# EAGLE design PIC32_Circuit (EAGLE 8.1.0)
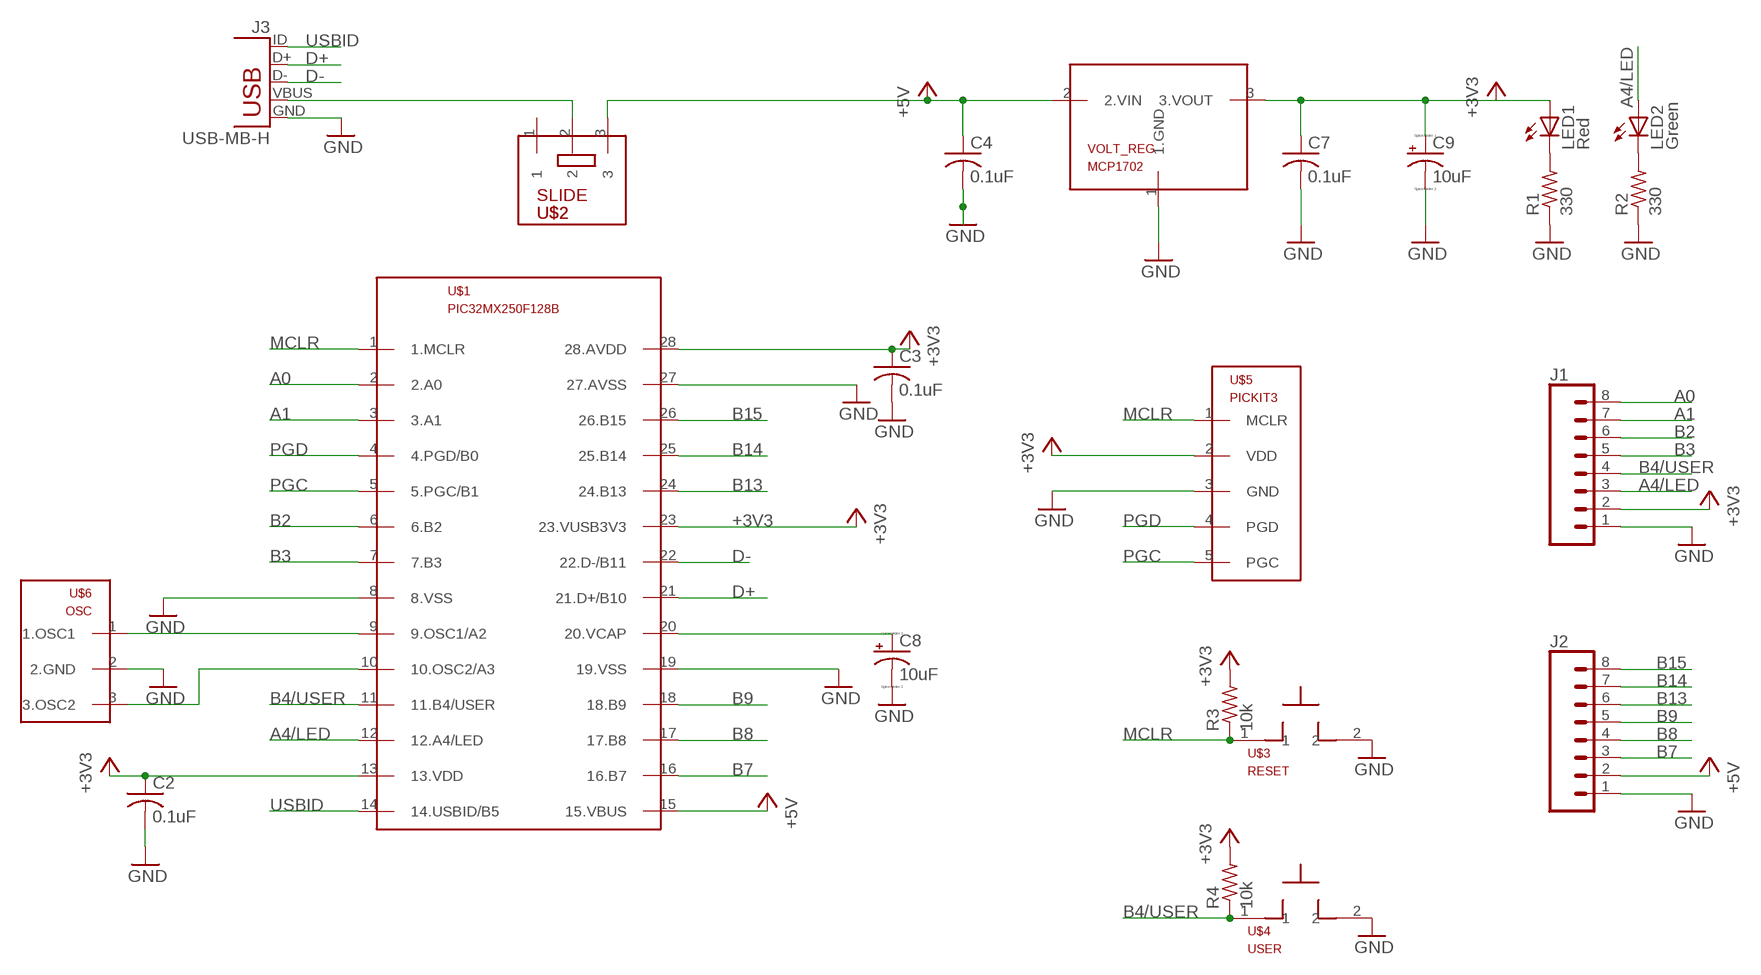
[diagram p0: schematic, sheet 1]

## Parts
C2  0.1uF  C-US025-050X050  [C025-050X050]
C3  0.1uF  C-US025-050X050  [C025-050X050]
C4  0.1uF  C-US025-050X050  [C025-050X050]
C7  0.1uF  C-US025-050X050  [C025-050X050]
C8  10uF  CPOL-USB45181B  [B45181B]
C9  10uF  CPOL-USB45181B  [B45181B]
J1  CONN_08"  [1X08]
J2  CONN_08"  [1X08]
J3  USB-MB-H  [USB-MB-H]
LED1  Red  LED3MM  [LED3MM]
LED2  Green  LED3MM  [LED3MM]
R1  330  R-US_0207/10  [0207/10]
R2  330  R-US_0207/10  [0207/10]
R3  10k  R-US_0207/10  [0207/10]
R4  10k  R-US_0207/10  [0207/10]
U$1  PIC32MX250F128B  [DIL28-3]
U$2  SLIDE  [SLIDE]
U$3  RESET  PB  [PB]
U$4  USER  PB  [PB]
U$5  PICKIT3  [1X05]
U$6  OSC  [OSC]
VOLT_REG  MCP1702  [TO92]

## Nets
+3V3: C2.1 C3.1 J1.2 R3.2 R4.2 U$1.13(13.VDD) U$1.23(23.VUSB3V3) U$1.28(28.AVDD) U$5.2(VDD)
+5V: C4.1 J2.2 U$1.15(15.VBUS) U$2.3 VOLT_REG.2(2.VIN)
A0: J1.8 U$1.2(2.A0)
A1: J1.7 U$1.3(3.A1)
A4/LED: J1.3 LED2.A U$1.12(12.A4/LED)
B2: J1.6 U$1.6(6.B2)
B3: J1.5 U$1.7(7.B3)
B4/USER: J1.4 R4.1 U$1.11(11.B4/USER) U$4.1
B7: J2.3 U$1.16(16.B7)
B8: J2.4 U$1.17(17.B8)
B9: J2.5 U$1.18(18.B9)
B13: J2.6 U$1.24(24.B13)
B14: J2.7 U$1.25(25.B14)
B15: J2.8 U$1.26(26.B15)
D+: J3.D+ U$1.21(21.D+/B10)
D-: J3.D- U$1.22(22.D-/B11)
GND: C2.2 C3.2 C4.2 C7.2 C8.- C9.- J1.1 J2.1 J3.GND R1.1 R2.1 U$1.8(8.VSS) U$1.19(19.VSS) U$1.27(27.AVSS) U$3.2 U$4.2 U$5.3(GND) U$6.2(2.GND) VOLT_REG.1(1.GND)
MCLR: R3.1 U$1.1(1.MCLR) U$3.1 U$5.1(MCLR)
N$1: LED1.K(C) R1.2
N$2: LED2.K(C) R2.2
N$3: C7.1 C9.+ LED1.A VOLT_REG.3(3.VOUT)
N$5: U$1.10(10.OSC2/A3) U$6.3(3.OSC2)
N$6: U$1.9(9.OSC1/A2) U$6.1(1.OSC1)
N$7: C8.+ U$1.20(20.VCAP)
PGC: U$1.5(5.PGC/B1) U$5.5(PGC)
PGD: U$1.4(4.PGD/B0) U$5.4(PGD)
USBID: J3.ID U$1.14(14.USBID/B5)
VBUS: J3.VBUS U$2.2
Unconnected: U$2.1

## Library data of the parts
C2-C4 C7 = PIC32-Circuit:C-US: CAPACITOR, American symbol
C8 C9 = PIC32-Circuit:CPOL-US: POLARIZED CAPACITOR, American symbol
J1 J2 = PIC32-Circuit:CONN_08: Multi connection point. Often used as Generic Header-pin footprint for 0.1 inch spaced/style header connections On any of the 0.1 inch spaced packages, you can populate with these: Break Away Headers - Straight <https://www.sparkfun.com/products/116> (PRT-00116) Break Away Male Headers - Right Angle <https://www.sparkfun.com/products/553> (PRT-00553) Female Headers <https://www.sparkfun.com/products/115> (PRT-00115) Break Away Headers - Machine Pin <https://www.sparkfun.com/products/117> (PRT-00117) Break Away Female Headers - Swiss Machine Pin <https://www.sparkfun.com/products/743> (PRT-00743) Arduino Stackable Header - 8 Pin <https://www.sparkfun.com/products/9279> (PRT-09279) For SCREWTERMINALS and SPRING TERMINALS visit here: Screw Terimnals on SparkFun.com <https://www.sparkfun.com/search/results?term=Screw+Terminals> (5mm/3.5mm/2.54mm spacing) This device is also useful as a general connection point to wire up your design to another part of your project. Our various solder wires solder well into these plated through hole pads. Hook-Up Wire - Assortment (Stranded, 22 AWG) <https://www.sparkfun.com/products/11375> (PRT-11375) Hook-Up Wire - Assortment (Solid Core, 22 AWG) <https://www.sparkfun.com/products/11367> (PRT-11367) View the entire wire category on our website here <https://www.sparkfun.com/categories/141> Special notes: Molex polarized connector foot print use with SKU : PRT-08231 with associated crimp pins and housings. 1MM SMD Version SKU: PRT-10208 NOTES ON THE VARIANTS LOCK and LOCK_LONGPADS... This footprint was designed to help hold the alignment of a through-hole component (i.e. 6-pin header) while soldering it into place. You may notice that each hole has been shifted either up or down by 0.005 of an inch from it's more standard position (which is a perfectly straight line). This slight alteration caused the pins (the squares in the middle) to touch the edges of the holes. Because they are alternating, it causes a "brace" to hold the component in place. 0.005 has proven to be the perfect amount of "off-center" position when using our standard breakaway headers. Although looks a little odd when you look at the bare footprint, once you have a header in there, the alteration is very hard to notice. Also,if you push a header all the way into place, it is covered up entirely on the bottom side.; PROD_ID: CONN-08438
J3 = PIC32-Circuit:USB: USB Connectors USB-B-PTH is fully proven SKU : PRT-00139/CONN-08278 USB-miniB is fully proven SKU : PRT-00587 USB-A-PCB is untested. USB-A-H is throughly reviewed, but untested. Spark Fun Electronics SKU : PRT-00437 USB-B-SMT is throughly reviewed, but untested. Needs silkscreen touching up. USB-A-S has not been used/tested USB-MB-H has not been used/tested USB-MICROB has been used. CONN-09505
LED1 = led:LED: LED OSRAM: - CHIPLED LG R971, LG N971, LY N971, LG Q971, LY Q971, LO R971, LY R971 LH N974, LH R974 LS Q976, LO Q976, LY Q976 LO Q996 - Hyper CHIPLED LW Q18S LB Q993, LB Q99A, LB R99A - SideLED LS A670, LO A670, LY A670, LG A670, LP A670 LB A673, LV A673, LT A673, LW A673 LH A674 LY A675 LS A676, LA A676, LO A676, LY A676, LW A676 LS A679, LY A679, LG A679 - Hyper Micro SIDELED® LS Y876, LA Y876, LO Y876, LY Y876 LT Y87S - SmartLED LW L88C, LW L88S LB L89C, LB L89S, LG L890 LS L89K, LO L89K, LY L89K LS L896, LA L896, LO L896, LY L896 - TOPLED LS T670, LO T670, LY T670, LG T670, LP T670 LSG T670, LSP T670, LSY T670, LOP T670, LYG T670 LG T671, LOG T671, LSG T671 LB T673, LV T673, LT T673, LW T673 LH T674 LS T676, LA T676, LO T676, LY T676, LB T676, LH T676, LSB T676, LW T676 LB T67C, LV T67C, LT T67C, LS T67K, LO T67K, LY T67K, LW E67C LS E67B, LA E67B, LO E67B, LY E67B, LB E67C, LV E67C, LT E67C LW T67C LS T679, LY T679, LG T679 LS T770, LO T770, LY T770, LG T770, LP T770 LB T773, LV T773, LT T773, LW T773 LH T774 LS E675, LA E675, LY E675, LS T675 LS T776, LA T776, LO T776, LY T776, LB T776 LHGB T686 LT T68C, LB T68C - Hyper Mini TOPLED® LB M676 - Mini TOPLED Santana® LG M470 LS M47K, LO M47K, LY M47K Source: http://www.osram.convergy.de LUXEON: - LUMILED® LXK2-PW12-R00, LXK2-PW12-S00, LXK2-PW14-U00, LXK2-PW14-V00 LXK2-PM12-R00, LXK2-PM12-S00, LXK2-PM14-U00 LXK2-PE12-Q00, LXK2-PE12-R00, LXK2-PE12-S00, LXK2-PE14-T00, LXK2-PE14-U00 LXK2-PB12-K00, LXK2-PB12-L00, LXK2-PB12-M00, LXK2-PB14-N00, LXK2-PB14-P00, LXK2-PB14-Q00 LXK2-PR12-L00, LXK2-PR12-M00, LXK2-PR14-Q00, LXK2-PR14-R00 LXK2-PD12-Q00, LXK2-PD12-R00, LXK2-PD12-S00 LXK2-PH12-R00, LXK2-PH12-S00 LXK2-PL12-P00, LXK2-PL12-Q00, LXK2-PL12-R00 Source: www.luxeon.com KINGBRIGHT: KA-3528ASYC Source: www.kingbright.com
LED2 = PIC32-Circuit:LED: LED OSRAM: - CHIPLED LG R971, LG N971, LY N971, LG Q971, LY Q971, LO R971, LY R971 LH N974, LH R974 LS Q976, LO Q976, LY Q976 LO Q996 - Hyper CHIPLED LW Q18S LB Q993, LB Q99A, LB R99A - SideLED LS A670, LO A670, LY A670, LG A670, LP A670 LB A673, LV A673, LT A673, LW A673 LH A674 LY A675 LS A676, LA A676, LO A676, LY A676, LW A676 LS A679, LY A679, LG A679 - Hyper Micro SIDELED® LS Y876, LA Y876, LO Y876, LY Y876 LT Y87S - SmartLED LW L88C, LW L88S LB L89C, LB L89S, LG L890 LS L89K, LO L89K, LY L89K LS L896, LA L896, LO L896, LY L896 - TOPLED LS T670, LO T670, LY T670, LG T670, LP T670 LSG T670, LSP T670, LSY T670, LOP T670, LYG T670 LG T671, LOG T671, LSG T671 LB T673, LV T673, LT T673, LW T673 LH T674 LS T676, LA T676, LO T676, LY T676, LB T676, LH T676, LSB T676, LW T676 LB T67C, LV T67C, LT T67C, LS T67K, LO T67K, LY T67K, LW E67C LS E67B, LA E67B, LO E67B, LY E67B, LB E67C, LV E67C, LT E67C LW T67C LS T679, LY T679, LG T679 LS T770, LO T770, LY T770, LG T770, LP T770 LB T773, LV T773, LT T773, LW T773 LH T774 LS E675, LA E675, LY E675, LS T675 LS T776, LA T776, LO T776, LY T776, LB T776 LHGB T686 LT T68C, LB T68C - Hyper Mini TOPLED® LB M676 - Mini TOPLED Santana® LG M470 LS M47K, LO M47K, LY M47K Source: http://www.osram.convergy.de LUXEON: - LUMILED® LXK2-PW12-R00, LXK2-PW12-S00, LXK2-PW14-U00, LXK2-PW14-V00 LXK2-PM12-R00, LXK2-PM12-S00, LXK2-PM14-U00 LXK2-PE12-Q00, LXK2-PE12-R00, LXK2-PE12-S00, LXK2-PE14-T00, LXK2-PE14-U00 LXK2-PB12-K00, LXK2-PB12-L00, LXK2-PB12-M00, LXK2-PB14-N00, LXK2-PB14-P00, LXK2-PB14-Q00 LXK2-PR12-L00, LXK2-PR12-M00, LXK2-PR14-Q00, LXK2-PR14-R00 LXK2-PD12-Q00, LXK2-PD12-R00, LXK2-PD12-S00 LXK2-PH12-R00, LXK2-PH12-S00 LXK2-PL12-P00, LXK2-PL12-Q00, LXK2-PL12-R00 Source: www.luxeon.com KINGBRIGHT: KA-3528ASYC Source: www.kingbright.com
R1-R4 = PIC32-Circuit:R-US_: RESISTOR, American symbol
U$1 = PIC32-Circuit:PIC32MX250F128B
U$2 = PIC32-Circuit:SLIDE
U$3 U$4 = PIC32-Circuit:PB
U$5 = PIC32-Circuit:PICKIT3
U$6 = PIC32-Circuit:OSC
VOLT_REG = PIC32-Circuit:MCP1702

## Board
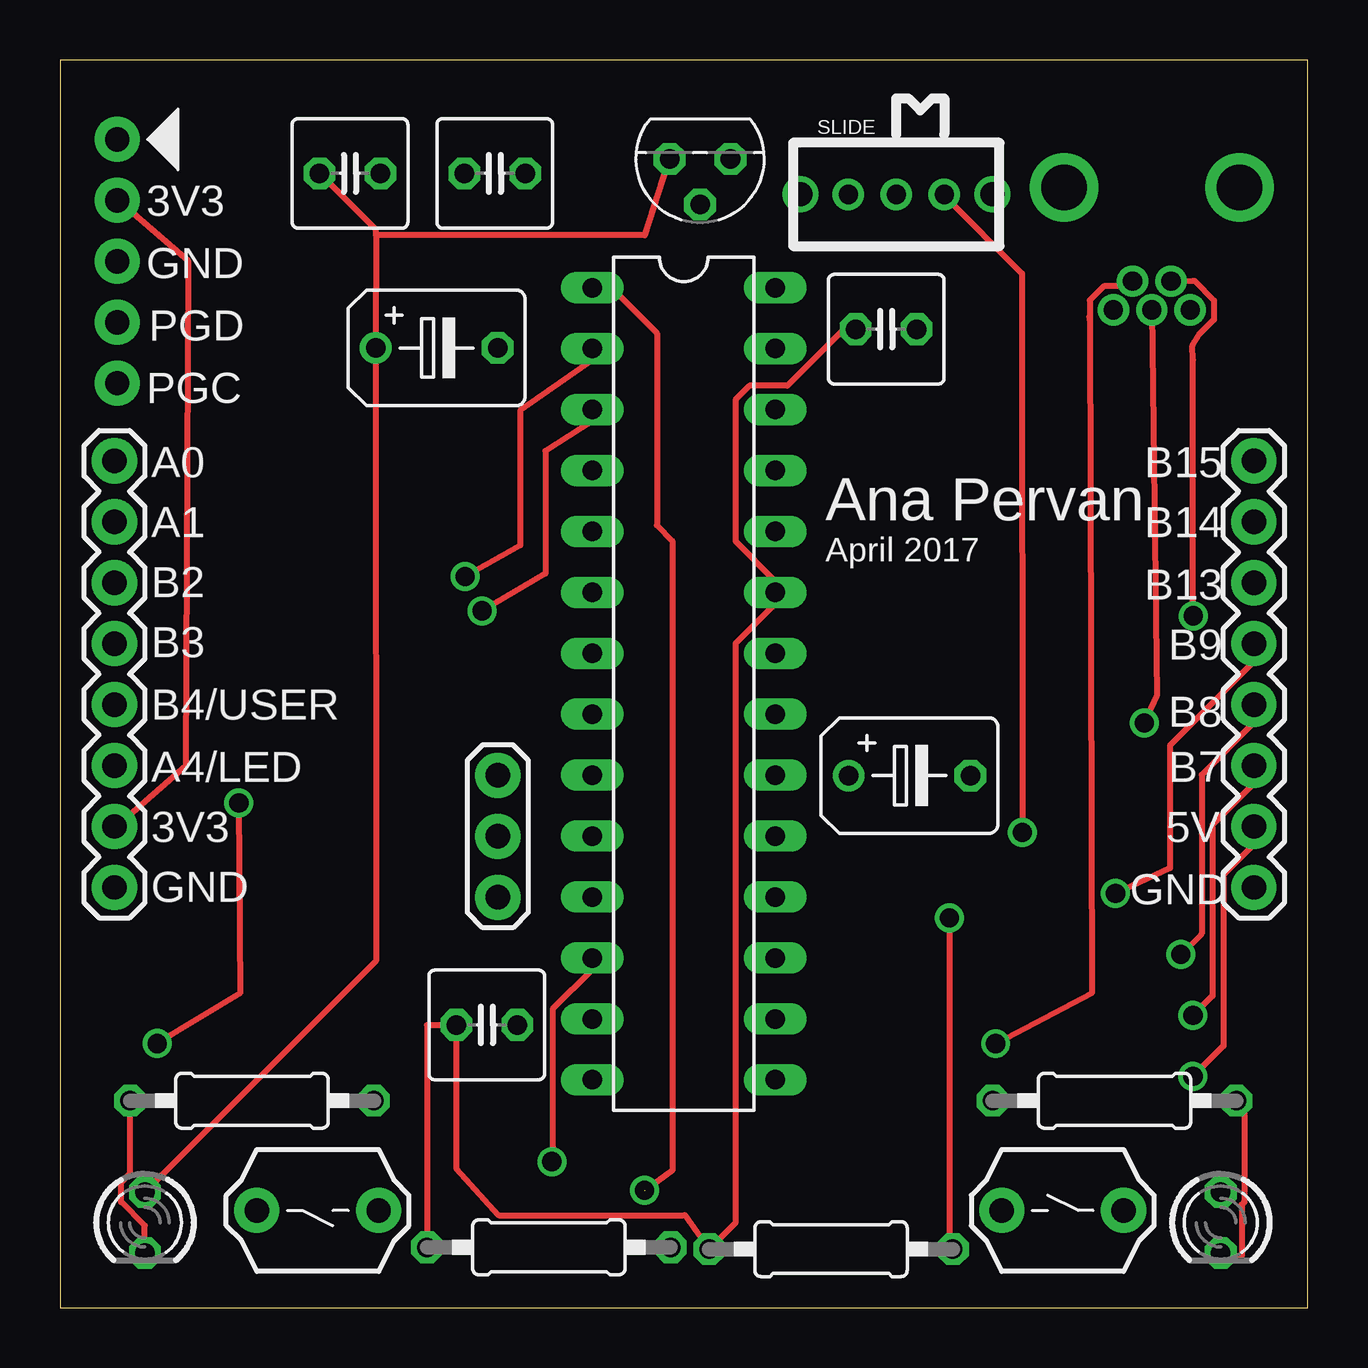
[diagram p1: board, top side]
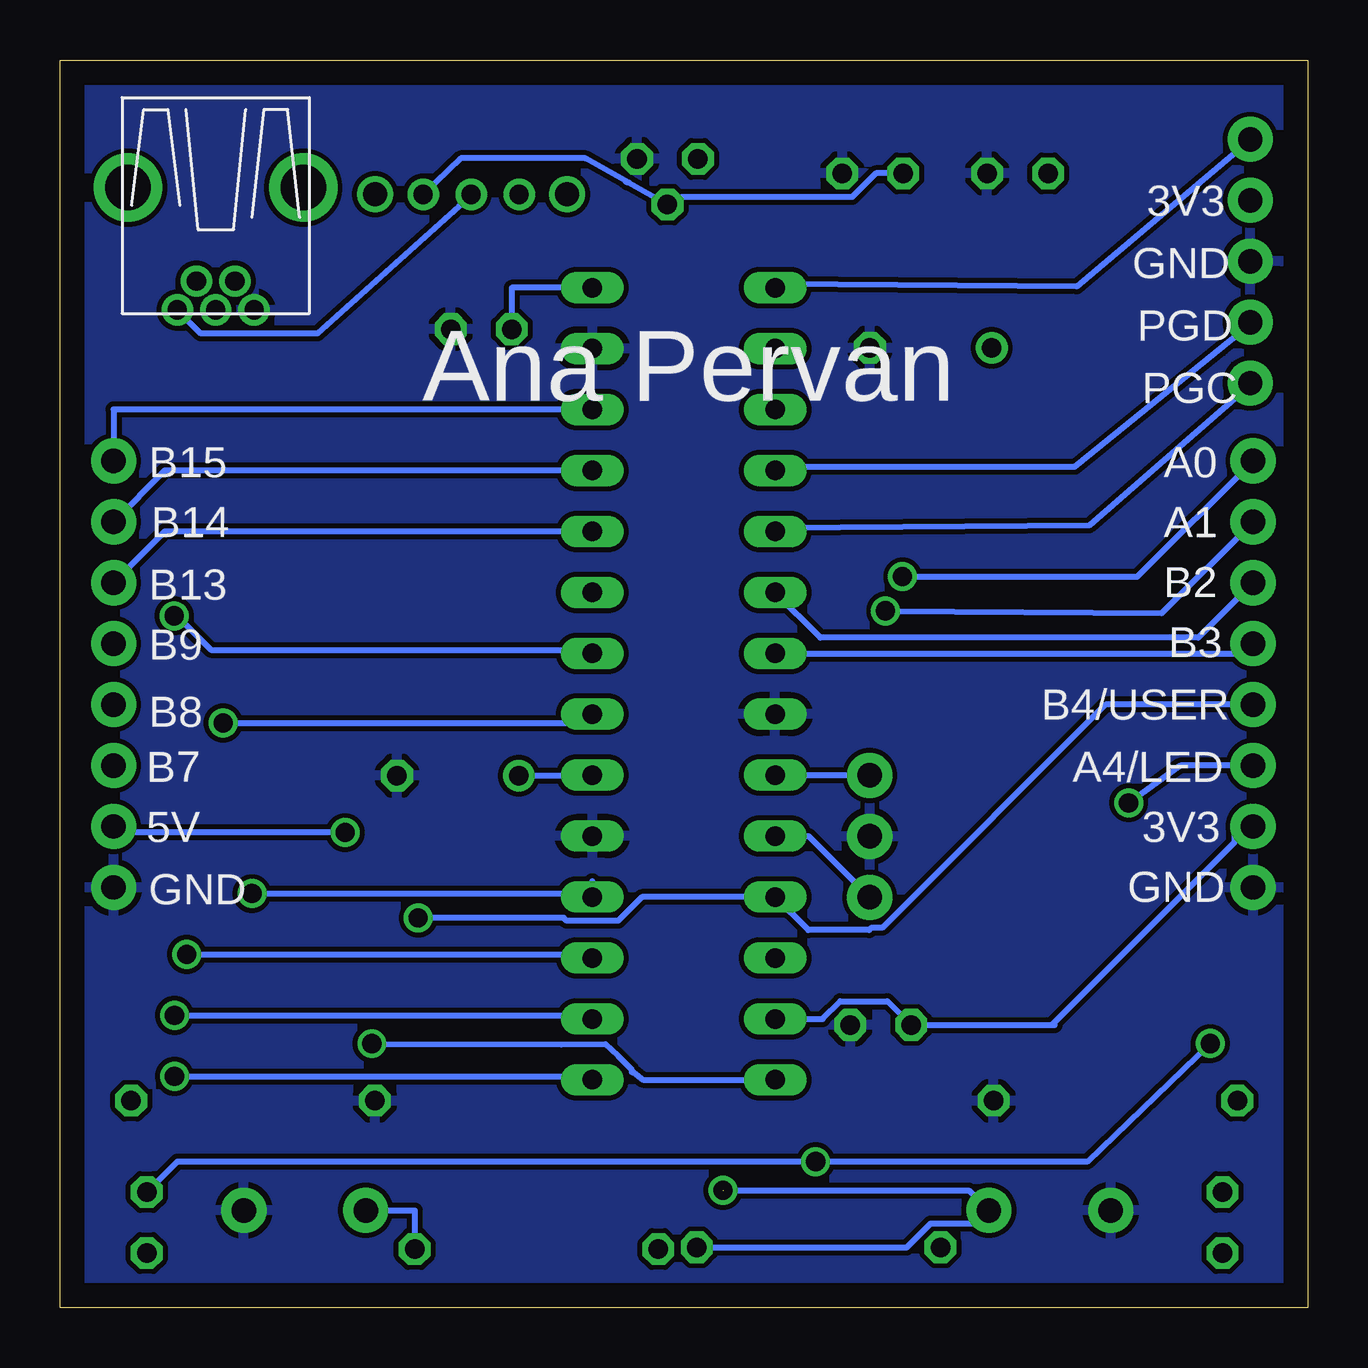
[diagram p2: board, bottom side, seen from below]

Size 52 x 52 mm. Coordinates in mm from the lower left corner, seen from the top.
Outline: 0,0 52,0 52,52 0,52 0,0
Copper layers (1*16): Top 0.035mm / dielectric 1.5mm / Bottom 0.035mm
Design rules "default": minimum track width 10mil, minimum drill 24mil, track to track 8mil, track to pad 8mil, pad to pad 8mil, via to via 8mil, smd to smd 8mil, copper to edge 40mil, drill to drill 8mil, minimum pad ring 10mil, minimum via ring 8mil, stop-mask expansion 4mil, vias tented up to drill 0mil, thermal gap 10mil

### Footprints (pad centres in the part's own frame; a part is rotated, then mirrored left to right if it is on the bottom)
C025-050X050 = drill 0.813 octagon: 1 -1.27,0; 2 1.27,0
B45181B = drill 0.813: + -2.54,0 | drill 0.813 octagon: - 2.54,0
1X08 = drill 1.016 pad 1.88: 1 0,0; 2 2.54,0; 3 5.08,0; 4 7.62,0; 5 10.16,0; 6 12.7,0; 7 15.24,0; 8 17.78,0
USB-MB-H = drill 0.8: D+ 5.1,0; D- 3.9,0.8; GND 5.1,-1.6; ID 3.9,-0.8; VBUS 5.1,1.6 | drill 1.9: P$6 0,-3.65; P$7 0,3.65
LED3MM = drill 0.813 octagon: A -1.27,0; K 1.27,0
0207/10 = drill 0.813 octagon: 1 -5.08,0; 2 5.08,0
DIL28-3 = drill 0.813 long: 1 -16.51,-3.81; 2 -13.97,-3.81; 3 -11.43,-3.81; 4 -8.89,-3.81; 5 -6.35,-3.81; 6 -3.81,-3.81; 7 -1.27,-3.81; 8 1.27,-3.81; 9 3.81,-3.81; 10 6.35,-3.81; 11 8.89,-3.81; 12 11.43,-3.81; 13 13.97,-3.81; 14 16.51,-3.81; 15 16.51,3.81; 16 13.97,3.81; 17 11.43,3.81; 18 8.89,3.81; 19 6.35,3.81; 20 3.81,3.81; 21 1.27,3.81; 22 -1.27,3.81; 23 -3.81,3.81; 24 -6.35,3.81; 25 -8.89,3.81; 26 -11.43,3.81; 27 -13.97,3.81; 28 -16.51,3.81
SLIDE = drill 0.8: 1 -2,0; 2 0,0; 3 2,0 | drill 1: P$1 -4,0; P$2 4,0
PB = drill 1.016 pad 1.88: 1 -2.54,0; 2 2.54,0
1X05 = drill 1.016 pad 1.88: 1 0,0; 2 2.54,0; 3 5.08,0; 4 7.62,0; 5 10.16,0
OSC = drill 1.016 pad 1.88: 1 -2.54,0; 2 0,0; 3 2.54,0
TO92 = drill 0.813 octagon: 1 -1.27,0; 2 0,1.905; 3 1.27,0

### Placement (x,y rotation side)
C2  17.79,11.78 0 top
C3  34.44,40.78 0 top
C4  18.12,47.27 0 top
C7  12.09,47.27 0 top
C8  35.41,22.17 0 top
C9  15.7,40 0 top
J1  2.27,17.51 90 top
J2  49.77,17.51 90 top
J3  45.51,46.68 270 top
LED1  3.54,3.54 270 top
LED2  48.38,3.54 270 top
R1  8,8.62 180 top
R2  43.95,8.62 0 top
R3  20.38,2.51 180 top
R4  32.14,2.43 180 top
U$1  26,26 270 top
U$2  34.86,46.4 0 top
U$3  10.74,4.05 180 top
U$4  41.79,4.05 0 top
U$5  2.39,48.69 270 top
U$6  18.25,19.64 270 top
VOLT_REG  26.68,47.88 180 top

### Tracks (layer width: path | path; a pad name or v marks a point on that pad's centre or on a via)
+3V3
  Top 0.254: J1.2 2.87,20.49 5.24,22.56 5.34,43.64 2.43,46.15 U$5.2 | C3.1 32.68,40.78 30.32,38.42 28.74,38.42 28.16,37.84 28.16,31.94 29.81,30.29 U$1.23 29.81,29.33 28.16,27.68 28.16,3.54 R4.2 26.04,3.85 18.27,3.85 16.52,5.8 C2.1 15.3,11.78 R3.2
  Bottom 0.254: 10.65,11.78 C2.1 17.51,12.77 19.47,12.77 20.21,12.03 U$1.13 | 10.65,11.78 10.54,11.78 | 10.65,11.78 3.03,19.4 3.03,19.8 2.27,19.8 J1.2 | U$1.28 33.17,42.51 C3.1
+5V  (via drill 0.8)
  Top 0.254: J2.2 49.77,19.31 48.5,18.04 48.5,10.91 v47.23,9.64 | U$2.3 36.86,46.34 40.1,43.1 v40.12,19.8
  Bottom 0.254: 29.81,9.64 U$1.15 29.96,9.64 v47.23,9.64 | v40.12,19.8 49.51,19.8 J2.2 | C4.1 17.99,47.27 18.98,46.28 26.08,46.28 VOLT_REG.2 28.3,46.89 28.36,46.89 28.43,46.96 30.1,47.9 35.3,47.9 U$2.3
A0  (via drill 0.8)
  Top 0.254: U$1.2 22.19,39.49 19.18,37.38 19.18,31.77 v16.88,30.46
  Bottom 0.254: v16.88,30.46 7.1,30.46 J1.8
A1  (via drill 0.8)
  Top 0.254: v17.59,29.04 20.24,30.59 20.24,35.7 22.19,36.95 U$1.3
  Bottom 0.254: v17.59,29.04 6.08,28.94 J1.7
A4/LED  (via drill 0.8)
  Top 0.254: U$1.12 22.19,14.09 20.54,12.44 20.54,6.12 v20.5,6.08 | v7.46,21.04 7.5,13.1 v4.06,11
  Bottom 0.254: J1.3 5.3,22.59 v7.46,21.04 | v4.06,11 9.18,6.08 v20.5,6.08 47.11,6.08 LED2.A
B2
  Bottom 0.254: J1.6 4.56,27.92 20.3,27.92 U$1.6
B3
  Bottom 0.254: U$1.7 2.27,27.27 J1.5
B4/USER  (via drill 0.8)
  Top 0.254: v37.07,16.24 37.07,2.58 R4.1
  Bottom 0.254: U$4.1 37.22,4.05 R4.1 | J1.4 8.42,25.13 17.72,15.83 18.17,15.83 18.27,15.73 20.81,15.73 U$1.11 27.75,17.11 28.74,16.12 30.88,16.12 31,16.24 v37.07,16.24
B7  (via drill 0.8)
  Top 0.254: J2.3 49.77,21.85 48.04,20.12 48.04,12.99 v47.23,12.18
  Bottom 0.254: 29.81,12.18 U$1.16 29.96,12.18 v47.23,12.18
B8  (via drill 0.8)
  Top 0.254: v46.72,14.72 47.58,15.58 47.58,22.2 49.77,24.39 J2.4
  Bottom 0.254: 29.81,14.72 U$1.17 29.96,14.72 v46.72,14.72
B9  (via drill 0.8)
  Top 0.254: v44,17.26 46.26,18.32 46.26,23.42 49.77,26.93 J2.5
  Bottom 0.254: 29.81,17.76 U$1.18 29.96,17.26 v44,17.26
B13
  Bottom 0.254: U$1.24 47.63,32.35 J2.6
B14
  Bottom 0.254: U$1.25 47.63,34.89 J2.7
B15
  Bottom 0.254: U$1.26 49.77,37.43 J2.8
D+  (via drill 0.8)
  Top 0.254: J3.D+ 45.71,25.48 v45.2,24.37
  Bottom 0.254: v45.2,24.37 30.17,24.37 U$1.21
D-  (via drill 0.8)
  Top 0.254: v47.24,28.83 47.23,28.43 47.23,39.51 47.2,40.1 47.52,40.6 48.09,41.17 48.09,41.99 47.3,42.8 47.2,42.8 J3.D-
  Bottom 0.254: v47.24,28.83 46.72,28.43 45.7,27.42 29.96,27.42 U$1.22
GND
  pour Bottom: 0,52 52,52 52,0 0,0
MCLR  (via drill 0.8)  (1 unrouted)
  Top 0.254: U$1.1 22.99,42.51 24.88,40.62 24.88,32.61 25.53,31.96 25.53,5.71 24.37,4.86
  Bottom 0.254: R3.1 16.7,2.51 15.71,3.5 13.83,3.5 U$3.1 14.12,4.88 v24.37,4.88 | U$5.1 2.59,48.49 9.62,42.56 22.04,42.66 U$1.1
N$1
  Top 0.254: LED1.K 3.54,3.41 2.55,4.4 2.55,5.22 2.92,5.59 R1.2
N$2
  Top 0.254: R2.2 49.38,8.28 49.38,4.4 49.26,4.29 49.26,2.14 48.38,2.14 LED2.K
N$3
  Top 0.254: C7.1 13.17,44.92 13.17,44.69 | 13.17,44.69 C9.+ 13.17,14.44 LED1.A | VOLT_REG.3 25.12,47.04 24.37,44.69 13.17,44.69
N$5
  Bottom 0.254: U$1.10 20.8,19.65 U$6.3
N$6
  Bottom 0.254: U$1.9 U$6.1
N$7
  Bottom 0.254: C8.+ 29.81,22.17 U$1.20
PGC
  Bottom 0.254: U$5.5 2.87,38.03 9.1,32.6 22.04,32.5 U$1.5
PGD
  Bottom 0.254: U$5.4 2.77,40.68 9.71,35.04 22.04,35.04 U$1.4
USBID  (via drill 0.8)
  Top 0.254: J3.ID 44.38,42.51 44.32,42.56 43.5,42.56 42.93,41.99 42.93,41.32 | 42.93,41.32 42.9,41.3 | 42.93,41.32 42.93,41.17 | 42.93,41.17 | 42.93,41.17 43,13.1 39.4,11.2 v39,11
  Bottom 0.254: v39,11 31.1,10.96 29.28,10.98 28.74,10.48 28.16,9.9 28.16,9.81 28.1,9.8 27.7,9.5 U$1.14
VBUS
  Bottom 0.254: U$2.2 35.37,45.9 41.27,40.6 44.32,40.6 45.1,40.6 46.13,40.6 J3.VBUS

### Text on the board
tPlace: 3V3 | GND | PGD | PGC | A0 | B15 | Ana Pervan | A1 | B14 | April 2017 | B2 | B13 | B3 | B9 | B4/USER | B8 | A4/LED | B7 | 3V3 | 5V | GND | GND
bPlace: 3V3 | GND | PGD | PGC | Ana Pervan | A0 | B15 | A1 | B14 | B2 | B13 | B3 | B9 | B4/USER | B8 | A4/LED | B7 | 3V3 | 5V | GND | GND